# Altium schematic sheet LT3045_3V3.SchDoc
size A4; SheetNumber: 9; SheetTotal: 27
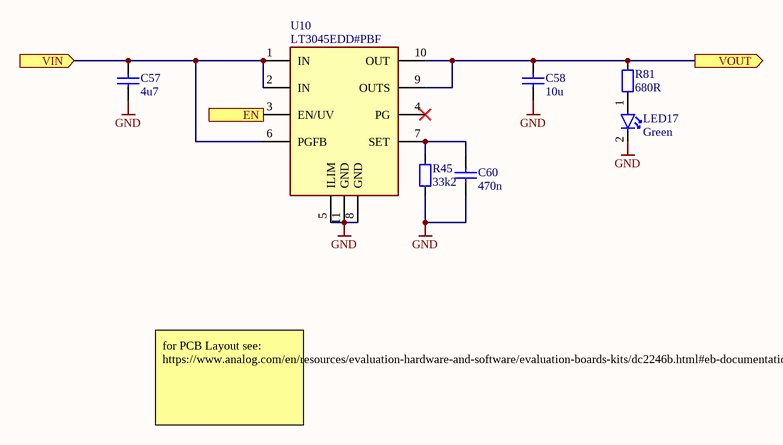
[diagram p0: LT3045_3V3.SchDoc]

## Parts
C57  4u7  [C_1206_3216Metric_IPC_N]
C58  10u  [C_1206_3216Metric_IPC_N]
C60  470n  [C_0402_1005Metric_IPC_N]
LED17  Green  [LED_0603_1806Metric_IPC_N]
R45  33k2  [R_0402_1005Metric_IPC_N]
R81  680R  [R_0402_1005Metric_IPC_N]
U10  LT3045EDD#PBF  [DFN10_3x3]

## Ports
EN (in, see Power_Supply[5C]), VIN (in, see Power_Supply[5C], LT3042_3V3[2B], TLV755P_3V3[2B], XC6204_1V8[2B]), VOUT (out, see Power_Supply[6C])

## Nets
GND: C57.1 C58.1 C60.1 LED17.2 R45.1 U10.5(ILIM) U10.8(GND) U10.11(GND)
EN: U10.3(EN/UV) ; port EN
VIN: C57.2 U10.1(IN) U10.2(IN) U10.6(PGFB) ; port VIN
VOUT: C58.2 R81.1 U10.9(OUTS) U10.10(OUT) ; port VOUT
NetC60_2: C60.2 R45.2 U10.7(SET)
NetLED17_1: LED17.1 R81.2

Not connected (* = marked no-connect by the designer): U10 4(PG)*

## Notes on the sheet
- for PCB Layout see:
  https://www.analog.com/en/resources/evaluation-hardware-and-software/evaluation-boards-kits/dc2246b.html#eb-documentation

## Library data of the parts
C57 C58 = C000005: Generic MLCC with 1206 Footprint; Specific Component: False; Temp Coefficient: X7R; Voltage Rated: 15V; ID: C000005; Tolerance: *; min Temperature: *; max Temperature: *; Case: 1206
  C57: Capacitance: 4u7
  C58: Capacitance: 10u
C60 = C000002: Generic MLCC with 0402 Footprint; Specific Component: False; Temp Coefficient: X7R; ID: C000002; Capacitance: 470n; Tolerance: *; Voltage Rated: *; min Temperature: *; max Temperature: *; Case: 0402
LED17 = LED000007: MLCC, Low Current, Green, 2.2V, 20mA, 0603; Manufacturer: Broadcom / Avago; Manufacturer Part Number: HSMG-C190; Specific Component: True; ID: LED000007; Type: Low Current; Colour: Green; Forward Voltage: 2.2V; Current: 20mA; Case: 0603; ComponentLink1Description: Datasheet; ComponentLink1URL: https://www.mouser.de/datasheet/3/57/1/AV02_0551EN_DS_HSMx_Cxxx_25Mar2022.pdf; Supplier 1: Mouser; Supplier Part Number 1: 630-HSMG-C190; Supplier 2: Digikey; Supplier Part Number 2: 516-1425-1-ND
R45 R81 = R000002: Generic Chip Resistor with 0402 Footprint; Specific Component: False; ID: R000002; Tolerance: *; Power Rating: *; Composition: *; min Temperature: *; max Temperature: *; Temp Coefficient: *; Case: 0402
  R45: Resistance: 33k2
  R81: Resistance: 680R
U10 = PMIC000030: Manufacturer: Analog Devices; ID: PMIC000030; Type: LDO; Manufacturer Part Number: LT3045EDD#PBF; Part Value: LT3045EDD#PBF; Case: 10-DFN (3x3); ComponentLink1Description: Datasheet; ComponentLink1URL: https://www.analog.com/media/en/technical-documentation/data-sheets/lt3045.pdf; Supplier 1: Digikey; Supplier Part Number 1: 505-LT3045EDD#PBF-ND; Supplier 2: Mouser; Supplier Part Number 2: 584-LT3045EDD#PBF